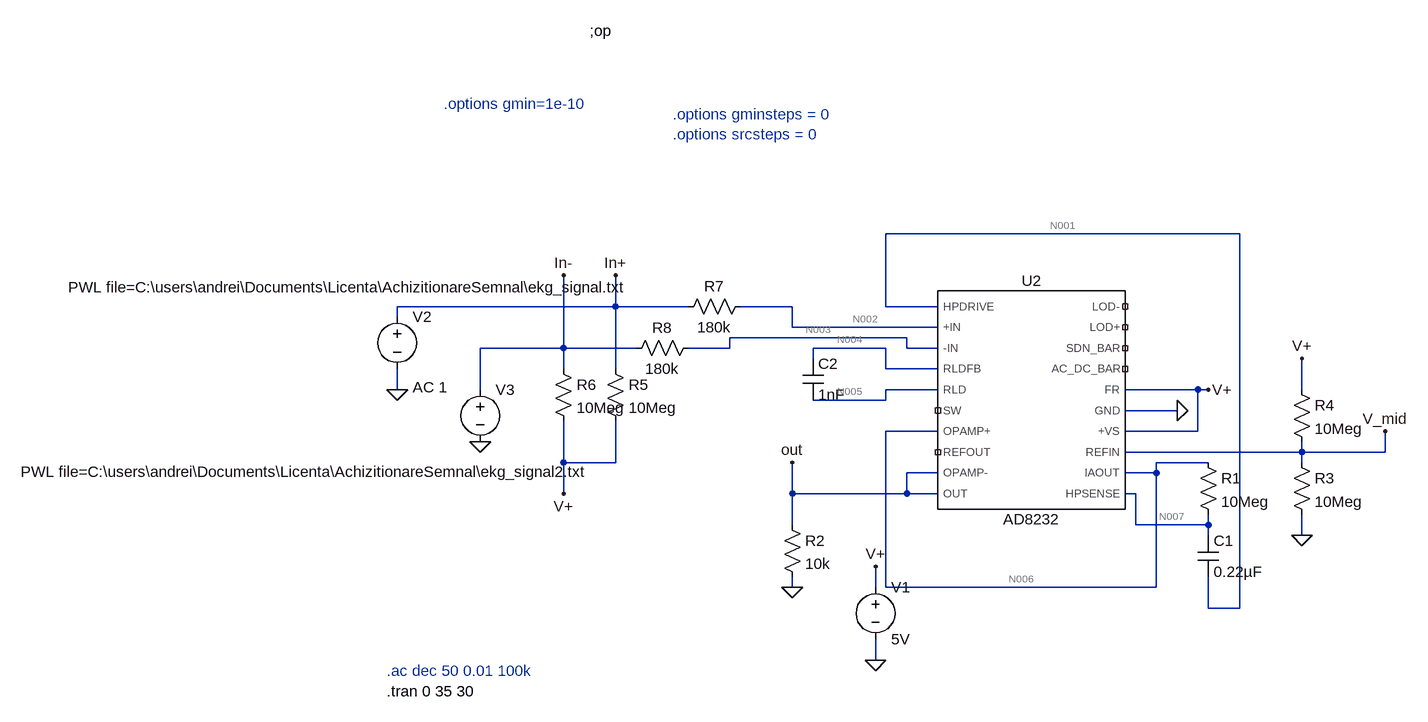
[diagram p0: schematic AD8232 EZ 3_20_20.asc]
AD8232 EZ 3_20_20.asc, the LTspice schematic file:
Version 4.1
SHEET 1 996 680
WIRE 720 -48 176 -48
WIRE -240 64 -240 16
WIRE -240 64 -576 64
WIRE -128 64 -240 64
WIRE 32 64 -48 64
WIRE 176 64 176 -48
WIRE 256 64 176 64
WIRE -576 80 -576 64
WIRE 32 96 32 64
WIRE 256 96 32 96
WIRE 208 112 -64 112
WIRE -320 128 -320 16
WIRE -320 128 -448 128
WIRE -208 128 -320 128
WIRE -64 128 -64 112
WIRE -64 128 -128 128
WIRE 176 128 64 128
WIRE 208 128 208 112
WIRE 256 128 208 128
WIRE 64 144 64 128
WIRE -320 160 -320 128
WIRE -240 160 -240 64
WIRE 176 160 176 128
WIRE 256 160 176 160
WIRE -576 192 -576 160
WIRE -448 192 -448 128
WIRE 256 192 176 192
WIRE 656 192 544 192
WIRE 672 192 656 192
WIRE 816 192 816 144
WIRE 176 208 176 192
WIRE 176 208 64 208
WIRE 624 224 544 224
WIRE 256 256 176 256
WIRE 656 256 656 192
WIRE 656 256 544 256
WIRE 816 288 816 272
WIRE 816 288 544 288
WIRE 944 288 944 256
WIRE 944 288 816 288
WIRE -320 304 -320 240
WIRE -240 304 -240 240
WIRE -240 304 -320 304
WIRE 672 304 592 304
WIRE 816 304 816 288
WIRE 256 320 208 320
WIRE 592 320 592 304
WIRE 592 320 544 320
WIRE -320 352 -320 304
WIRE 32 352 32 304
WIRE 208 352 208 320
WIRE 208 352 32 352
WIRE 256 352 208 352
WIRE 560 352 544 352
WIRE 32 400 32 352
WIRE 560 400 560 352
WIRE 672 400 672 384
WIRE 672 400 560 400
WIRE 672 416 672 400
WIRE 816 416 816 384
WIRE 32 496 32 480
WIRE 160 496 160 464
WIRE 176 496 176 256
WIRE 592 496 592 320
WIRE 592 496 176 496
WIRE 672 528 672 480
WIRE 720 528 720 -48
WIRE 720 528 672 528
WIRE 160 608 160 576
FLAG 160 608 0
FLAG 160 464 V+
FLAG 32 496 0
FLAG 816 416 0
FLAG 816 144 V+
FLAG 944 256 V_mid
FLAG -320 352 V+
FLAG 672 192 V+
FLAG 624 224 0
FLAG -240 16 In+
FLAG -320 16 In-
FLAG 32 304 out
FLAG -576 192 0
FLAG -448 272 0
SYMBOL cap 656 416 R0
SYMATTR InstName C1
SYMATTR Value 0.22µF
SYMBOL cap 48 144 R0
SYMATTR InstName C2
SYMATTR Value 1nF
SYMBOL LTCSymbols\\VOLTAGE 160 480 R0
WINDOW 123 0 0 Left 0
WINDOW 39 0 0 Left 0
SYMATTR InstName V1
SYMATTR Value 5V
SYMBOL res 16 384 R0
SYMATTR InstName R2
SYMATTR Value 10k
SYMBOL res 800 288 R0
SYMATTR InstName R3
SYMATTR Value 10Meg
SYMBOL res 800 176 R0
SYMATTR InstName R4
SYMATTR Value 10Meg
SYMBOL res -256 144 R0
SYMATTR InstName R5
SYMATTR Value 10Meg
SYMBOL res -336 144 R0
SYMATTR InstName R6
SYMATTR Value 10Meg
SYMBOL res -32 48 R90
WINDOW 0 0 56 VBottom 2
WINDOW 3 32 56 VTop 2
SYMATTR InstName R7
SYMATTR Value 180k
SYMBOL res -112 112 R90
WINDOW 0 0 56 VBottom 2
WINDOW 3 32 56 VTop 2
SYMATTR InstName R8
SYMATTR Value 180k
SYMBOL LTCSymbols\\VOLTAGE -576 64 R0
WINDOW 123 24 124 Left 2
WINDOW 39 0 0 Left 0
WINDOW 3 -506 -30 Left 2
SYMATTR Value2 AC 1
SYMATTR Value PWL file=C:\users\andrei\Documents\Licenta\AchizitionareSemnal\ekg_signal.txt
SYMATTR InstName V2
SYMBOL res 656 288 R0
SYMATTR InstName R1
SYMATTR Value 10Meg
SYMBOL AD8232 400 208 R0
SYMATTR InstName U2
SYMBOL voltage -448 176 R0
WINDOW 123 0 0 Left 0
WINDOW 39 0 0 Left 0
WINDOW 3 -707 142 Left 2
SYMATTR InstName V3
SYMATTR Value PWL file=C:\users\andrei\Documents\Licenta\AchizitionareSemnal\ekg_signal2.txt
TEXT -280 -360 Left 2 !;op
TEXT -504 -248 Left 2 ;.options gmin=1e-10
TEXT -152 -232 Left 2 ;.options gminsteps = 0\n.options srcsteps = 0
TEXT -592 624 Left 2 ;.ac dec 50 0.01 100k
TEXT -592 656 Left 2 !.tran 0 35 30

The netlist it stands for:
* AD8232 EZ 3_20_20.asc
C1 N007 N001 0.22µF
C2 N004 N005 1nF
V1 V+ 0 5V
R2 out 0 10k
R3 V_mid 0 10Meg
R4 V+ V_mid 10Meg
R5 In+ V+ 10Meg
R6 In- V+ 10Meg
R7 N002 In+ 180k
R8 N003 In- 180k
V2 In+ 0 PWL file=C:\users\andrei\Documents\Licenta\AchizitionareSemnal\ekg_signal.txt AC 1
R1 N006 N007 10Meg
X§U2 N001 N002 N003 N004 N005 NC_01 N006 NC_02 out out NC_03 NC_04 NC_05 NC_06 V+ 0 V+ V_mid N006 N007 AD8232  ; pins HPDRIVE +IN -IN RLDFB RLD SW OPAMP+ REFOUT OPAMP- OUT LOD- LOD+ SDN_BAR AC_DC_BAR FR GND +VS REFIN IAOUT HPSENSE
V3 In- 0 PWL file=C:\users\andrei\Documents\Licenta\AchizitionareSemnal\ekg_signal2.txt
;op
* .options gmin=1e-10
* .options gminsteps = 0
* .options srcsteps = 0
* .ac dec 50 0.01 100k
.tran 0 35 30
.lib AD8232.cir
.backanno
.end

* Results of the author's LTspice run, read from the files saved beside the schematic
* Operating Point, zero values left out:
*   V(in+) = -435 µV
*   V(in-) = 675 µV
*   V(n001) = 2.497 V
*   V(n002) = -426 µV
*   V(n003) = 666 µV
*   V(n004) = 9.977 mV
*   V(n005) = 4.882 V
*   V(n006) = 2.498 V
*   V(n007) = 2.498 V
*   V(out) = 2.497 V
*   V(v+) = 5 V
*   V(v_mid) = 2.5 V
*   I(R2) = 249.7 µA
*   I(R3) = 250 nA
*   I(R4) = 250 nA
*   I(R5) = -500 nA
*   I(R6) = -499.9 nA
*   I(R7) = 50 pA
*   I(R8) = -50 pA
*   I(V1) = -171.3 µA
*   I(V2) = 500.1 nA
*   I(V3) = 499.9 nA
*   Ix(u2:+in) = -50 pA
*   Ix(u2:+vs) = 170 µA
*   Ix(u2:-in) = 50 pA
*   Ix(u2:iaout) = -50 pA
*   Ix(u2:opamp+) = 50 pA
*   Ix(u2:opamp-) = -50 pA
*   Ix(u2:out) = -249.7 µA
*   Ix(u2:refin) = 100 pA
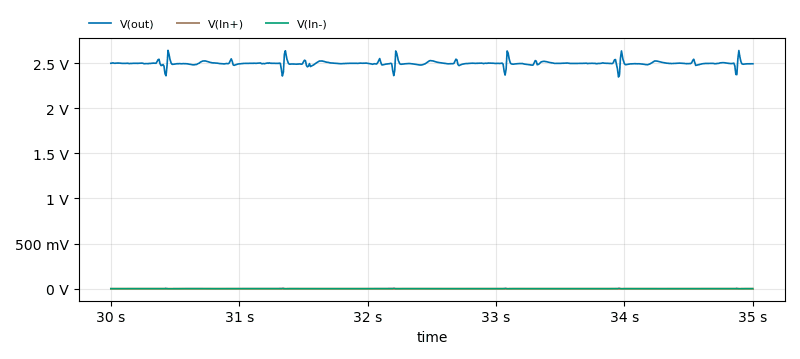
[diagram p1: Transient Analysis of AD8232 EZ 3_20_20.asc, plotted from the saved traces]
* Transient Analysis, 1 run:
*   V(out): min 2.346 V, max 2.641 V, average 2.497 V, rms 2.498 V, last 2.493 V
*   V(In+): min -195 µV, max 829.5 µV, average -71.16 µV, rms 157.4 µV, last -105 µV
*   V(In-): min -1.565 mV, max 2.425 mV, average -53.92 µV, rms 472.6 µV, last 115 µV